# Altium schematic sheet ATMEGA32U4+Micro+Ver1.1.schdoc
size 303 x 221 mm
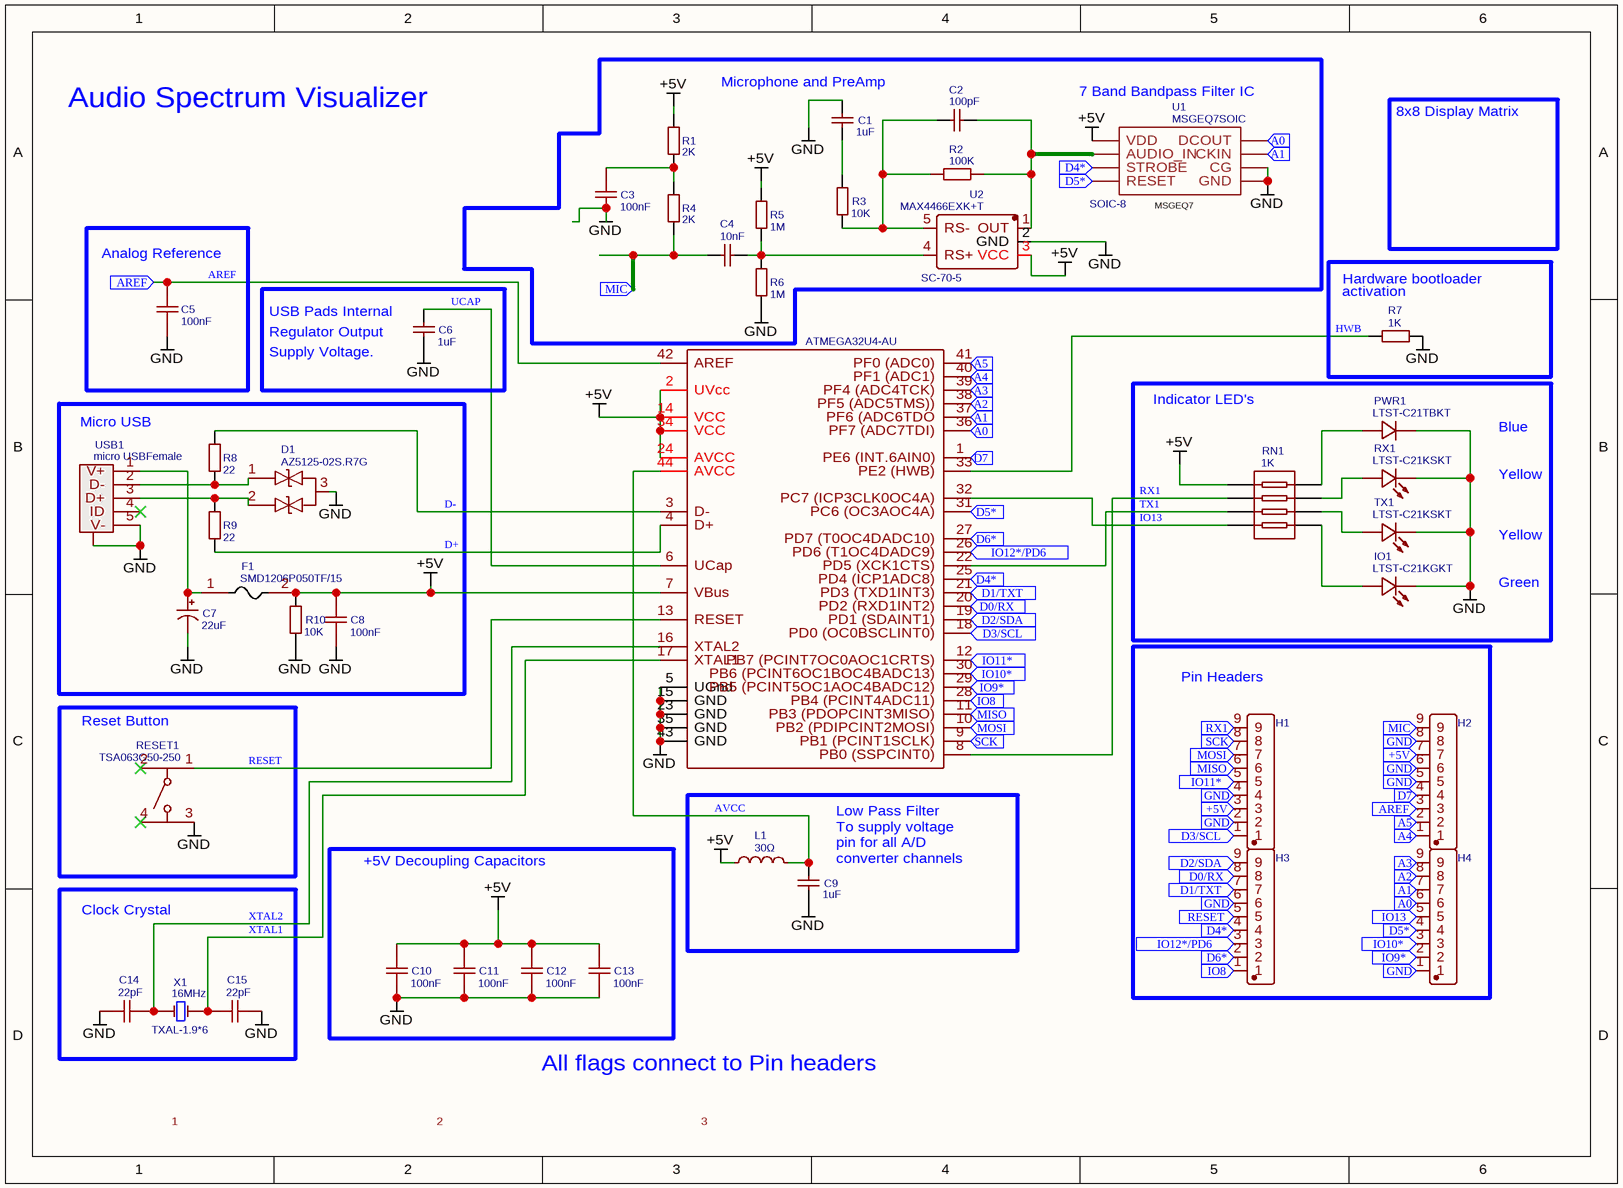
[diagram p0: ATMEGA32U4+Micro+Ver1.1.schdoc]

## Parts
ATMEGA1U4-AU  ATMEGA32U4-AU  [QFP-44_10X10X08P]
C1  1uF  [0603]
C2  100pF  [0603]
C3  100nF  [0603]
C4  10nF  [0603]
C5  100nF  [0603]
C6  1uF  [0603]
C7  22uF  [CAP-SMD_BD5.0-L5.3-W5.3-FD]
C8  100nF  [0603]
C9  1uF  [0603]
C10  100nF  [0603]
C11  100nF  [0603]
C12  100nF  [0603]
C13  100nF  [0603]
C14  22pF  [0805]
C15  22pF  [0805]
D1  AZ5125-02S.R7G  [SOT-23-3_L2.9-W1.6-P1.90-LS2.8-BR]
F1  SMD1206P050TF/15  [FUSE-1206]
H1  A2541WV-9P  [SIP-2.54MM-9P-CJT-H8.54]  (value not drawn)
H2  A2541WV-9P  [SIP-2.54MM-9P-CJT-H8.54]  (value not drawn)
H3  A2541WV-9P  [SIP-2.54MM-9P-CJT-H8.54]  (value not drawn)
H4  A2541WV-9P  [SIP-2.54MM-9P-CJT-H8.54]  (value not drawn)
IO1  LTST-C21KGKT  [LED-SMD-3.2X1.6X1.1]
L1  30Ω  [0805]
PWR1  LTST-C21TBKT  [LED-SMD-3.2X1.6X1.1]
R1  2K  [0603]
R2  100K  [0603]
R3  10K  [0805]
R4  2K  [0603]
R5  1M  [0603]
R6  1M  [0603]
R7  1K  [0805]
R8  22  [0805]
R9  22  [0805]
R10  10K  [0805]
RESET1  TSA063G50-250  [SW-SMD-T6X6-9.5X5.8]
RN1  1K  [1206_X4]
RX1  LTST-C21KSKT  [LED-SMD-3.2X1.6X1.1]
TX1  LTST-C21KSKT  [LED-SMD-3.2X1.6X1.1]
U1  MSGEQ7SOIC  [SOIC-8]
U2  MAX4466EXK+T  [SC-70-5]
USB1  micro USBFemale  [MICRO-USB-1]
X1  16MHz  [TXAL-1.9*6]

## Blocks framed on the sheet
Analog Reference: C5
Micro USB: C7 C8 D1 F1 R8-R10 USB1
Pin Headers: H1-H4
Reset Button: RESET1
+5V Decoupling Capacitors: C10-C13
Clock Crystal: C14 C15 X1

## Ports
+5V, A0, A1, A2, A3, A4, A5, AREF, D0/RX, D1/TXT, D2/SDA, D3/SCL, D4*, D5*, D6*, D7, GND, IO8, IO9*, IO10*, IO11*, IO12*/PD6, IO13, MIC, MISO, MOSI, RESET, RX1, SCK

## Nets
+5V: ATMEGA1U4-AU.2(UVcc) ATMEGA1U4-AU.7(VBus) ATMEGA1U4-AU.14(VCC) ATMEGA1U4-AU.24(AVCC) ATMEGA1U4-AU.34(VCC) C8.2 C10.2 C11.2 C12.2 C13.2 F1.2 L1.1 R1.2 R5.2 R10.2 RN1.5 U1.1(VDD) U2.3(VCC)
GND: ATMEGA1U4-AU.5(UGnd) ATMEGA1U4-AU.15(GND) ATMEGA1U4-AU.23(GND) ATMEGA1U4-AU.35(GND) ATMEGA1U4-AU.43(GND) C1.2 C3.1 C5.1 C6.1 C7.2 C8.1 C9.1 C10.1 C11.1 C12.1 C13.1 C14.1 C15.2 D1.3 IO1.1(C) PWR1.2(-) R6.1 R7.1 R10.1 RESET1.3 RX1.1(C) TX1.1(C) U1.2(GND) U1.6(CG) U2.2(GND) USB1.0(MTN) USB1.5(V-)
+5V: H1.3 H2.7 ; port +5V  [a separate net that carries the same name]
A0: ATMEGA1U4-AU.36(PF7_(ADC7TDI)) H4.6 U1.3(DCOUT) ; port A0
A1: ATMEGA1U4-AU.37(PF6_(ADC6TDO) H4.7 U1.8(CKIN) ; port A1
A2: ATMEGA1U4-AU.38(PF5_(ADC5TMS))) H4.8 ; port A2
A3: ATMEGA1U4-AU.39(PF4_(ADC4TCK)) H4.9 ; port A3
A4: ATMEGA1U4-AU.40(PF1_(ADC1)) H2.1 ; port A4
A5: ATMEGA1U4-AU.41(PF0_(ADC0)) H2.2 ; port A5
AREF: ATMEGA1U4-AU.42(AREF) C5.2 H2.3 ; port AREF
AVCC: ATMEGA1U4-AU.44(AVCC) C9.2 L1.2
D0/RX: ATMEGA1U4-AU.20(PD2_(RXD1INT2)) H3.8 ; port D0/RX
D1/TXT: ATMEGA1U4-AU.21(PD3_(TXD1INT3)) H3.7 ; port D1/TXT
D2/SDA: ATMEGA1U4-AU.19(PD1_(SDAINT1)) H3.9 ; port D2/SDA
D3/SCL: ATMEGA1U4-AU.18(PD0_(OC0BSCLINT0)) H1.1 ; port D3/SCL
D4*: ATMEGA1U4-AU.25(PD4_(ICP1ADC8)) H3.4 U1.4(STROBE) ; port D4*
D5*: ATMEGA1U4-AU.31(PC6_(OC3AOC4A)) H4.4 U1.7(RESET) ; port D5*
D6*: ATMEGA1U4-AU.27(PD7_(T0OC4DADC10)) H3.2 ; port D6*
D7: ATMEGA1U4-AU.1(PE6_(INT.6AIN0)) H2.4 ; port D7
D+: ATMEGA1U4-AU.4(D+) R9.2
D-: ATMEGA1U4-AU.3(D-) R8.2
GND: H1.2 H1.4 H2.5 H2.6 H2.8 H3.6 H4.1 ; port GND  [a separate net that carries the same name]
HWB: ATMEGA1U4-AU.33(PE2_(HWB)) R7.2
IO8: ATMEGA1U4-AU.28(PB4_(PCINT4ADC11)) H3.1 ; port IO8
IO9*: ATMEGA1U4-AU.29(PB5_(PCINT5OC1AOC4BADC12)) H4.2 ; port IO9*
IO10*: ATMEGA1U4-AU.30(PB6_(PCINT6OC1BOC4BADC13)) H4.3 ; port IO10*
IO11*: ATMEGA1U4-AU.12(PB7_(PCINT7OC0AOC1CRTS)) H1.5 ; port IO11*
IO12*/PD6: ATMEGA1U4-AU.26(PD6_(T1OC4DADC9)) H3.3 ; port IO12*/PD6
IO13: ATMEGA1U4-AU.32(PC7_(ICP3CLK0OC4A)) RN1.8
IO13: H4.5 ; port IO13  [a separate net that carries the same name]
MIC: C4.1 H2.9 R4.1 ; port MIC
MISO: ATMEGA1U4-AU.11(PB3_(PDOPCINT3MISO)) H1.6 ; port MISO
MOSI: ATMEGA1U4-AU.10(PB2_(PDIPCINT2MOSI)) H1.7 ; port MOSI
RESET: ATMEGA1U4-AU.13(RESET) RESET1.1
RESET: H3.5 ; port RESET  [a separate net that carries the same name]
RX1: ATMEGA1U4-AU.8(PB0_(SSPCINT0)) RN1.6
RX1: H1.9 ; port RX1  [a separate net that carries the same name]
SCK: ATMEGA1U4-AU.9(PB1_(PCINT1SCLK)) H1.8 ; port SCK
TX1: ATMEGA1U4-AU.22(PD5_(XCK1CTS)) RN1.7
UCAP: ATMEGA1U4-AU.6(UCap) C6.2
XTAL1: ATMEGA1U4-AU.17(XTAL1) C15.1 X1.2(OSC2)
XTAL2: ATMEGA1U4-AU.16(XTAL2) C14.2 X1.1(OSC1)
NetC1_1: C1.1 R3.2
NetC2_1: C2.1 R2.2 R3.1 U2.5(RS-)
NetC2_2: C2.2 R2.1 U1.5(AUDIO_IN) U2.1(OUT)
NetC3_2: C3.2 R1.1 R4.2
NetC4_2: C4.2 R5.1 R6.2 U2.4(RS+)
NetC7_1: C7.1 F1.1 USB1.1(V+)
NetD1_1: D1.1 R8.1 USB1.2(D-)
NetD1_2: D1.2 R9.1 USB1.3(D+)
NetIO1_2: IO1.2(A) RN1.1
NetPWR1_1: PWR1.1(+) RN1.4
NetRN1_2: RN1.2 TX1.2(A)
NetRN1_3: RN1.3 RX1.2(A)

Not connected (* = marked no-connect by the designer): RESET1 2* 4*; USB1 4(ID)*

## Notes on the sheet
- Audio Spectrum Visualizer
- (near C1) Microphone and PreAmp
- (near U1) 7 Band Bandpass Filter IC
- 8x8 Display Matrix
- (near C6) USB Pads Internal
- (near R7) activation
- (near R7) Hardware bootloader
- (near C6) Regulator Output
- Supply Voltage.
- Indicator LED's
- Blue
- Yellow
- Green
- Low Pass Filter
- To supply voltage
- pin for all A/D
- (near C9) converter channels
- All flags connect to Pin headers
- 1
- 2
- 3
- (in symbol 16MHz) TXAL-1.9*6
- (in symbol MAX4466EXK+T) SC-70-5
- (in symbol MSGEQ7SOIC) SOIC-8; MSGEQ7

## Library data of the parts
ATMEGA1U4-AU = ATMEGA32U4-AU: BOM_Manufacturer: MICROCHIP; SMT Type: Extend; BOM_Supplier: LCSC; BOM_Manufacturer Part: ATMEGA32U4-AU; image: //image.lceda.cn/szlcsc/C44854.jpg; BOM_Supplier Part: C44854; BOM_LCSC Assembly: Yes; spicePre: U
C1 C6 C9 = 1uF: BOM_Manufacturer Part: CL10A105KP8NNNC; BOM_Manufacturer: SAMSUNG; nameAlias: Capacitance; BOM_Supplier: LCSC; BOM_Supplier Part: C26413; spicePre: C; spiceSymbolName: CL10A105KP8NNNC
C2 = 100pF: BOM_Manufacturer: FH; BOM_Manufacturer Part: 0603CG101J500NT; nameAlias: Capacitance; SMT Type: Extend; BOM_Supplier: LCSC; BOM_Supplier Part: C1635; BOM_LCSC Assembly: Yes; spicePre: C; spiceSymbolName: 0603CG101J500NT
C3 C5 C8 C10-C13 = 100nF: BOM_Manufacturer: FH; BOM_Manufacturer Part: 0603B104J500NT; nameAlias: Capacitance; BOM_Supplier: LCSC; BOM_Supplier Part: C88136; spicePre: C; spiceSymbolName: 0603B104J500NT
C4 = 10nF: BOM_Manufacturer: FH; BOM_Manufacturer Part: 0603B103J500NT; nameAlias: Capacitance; Contributor: LCSC; BOM_Supplier: LCSC; BOM_Supplier Part: C124567; spicePre: C; spiceSymbolName: 0603B103J500NT
C7 = 22uF: BOM_Manufacturer: HONOR; BOM_Manufacturer Part: RVT1V220M0505; nameAlias: Capacitance; BOM_Supplier: LCSC; BOM_Supplier Part: C23289; spicePre: C; spiceSymbolName: RVT1V220M0505-C23289
C14 C15 = 22pF: BOM_Manufacturer: FH; BOM_Manufacturer Part: 0805CG220J500NT; nameAlias: Capacitance; BOM_Supplier: LCSC; BOM_Supplier Part: C24658; spicePre: C; spiceSymbolName: 0805CG220J500NT
D1 = AZ5125-02S.R7G: BOM_Manufacturer: AMAZING; Contributor: LCSC; BOM_Supplier: LCSC; BOM_Supplier Part: C356820; BOM_Manufacturer Part: AZ5125-02S.R7G; spicePre: D
F1 = SMD1206P050TF/15: BOM_Manufacturer: PTTC; BOM_Supplier: LCSC; BOM_Manufacturer Part: SMD1206P050TF/15; BOM_Supplier Part: C106264; spicePre: F
H1-H4 = A2541WV-9P: BOM_Manufacturer: Changjiang Connectors; Contributor: LCSC; BOM_Supplier: LCSC; BOM_Supplier Part: C225484; BOM_Manufacturer Part: A2541WV-9P; spicePre: H
IO1 = LTST-C21KGKT: BOM_Manufacturer: Lite-On; Contributor: LCSC; BOM_Supplier: LCSC; BOM_Supplier Part: C284938; BOM_Manufacturer Part: LTST-C21KGKT; spicePre: L
L1 = 30Ω: BOM_Manufacturer: ReliaPro; BOM_Manufacturer Part: MLB2012-300P3A(f); nameAlias: Value; BOM_Supplier: LCSC; BOM_Supplier Part: C50503; spicePre: L; spiceSymbolName: MLB2012-300P3A(f)
PWR1 = LTST-C21TBKT: BOM_Manufacturer: Lite-On; Contributor: LCSC; BOM_Supplier: LCSC; BOM_Supplier Part: C284941; BOM_Manufacturer Part: LTST-C21TBKT; spicePre: L
R1 R4 = 2K: BOM_Manufacturer: YAGEO; BOM_Manufacturer Part: RC0603FR-072KL; nameAlias: Resistance (Ohms); BOM_Supplier: LCSC; BOM_Supplier Part: C105576; spicePre: R; spiceSymbolName: RC0603FR-072KL
R2 = 100K: BOM_Manufacturer: YAGEO; BOM_Manufacturer Part: RC0603FR-07100KL; nameAlias: Resistance (Ohms); Contributor: LCSC; BOM_Supplier: LCSC; BOM_Supplier Part: C14675; spicePre: R; spiceSymbolName: RC0603FR-07100KL
R3 R10 = 10K: BOM_Manufacturer: YAGEO; BOM_Manufacturer Part: RC0805FR-0710KL; nameAlias: Resistance (Ohms); BOM_Supplier: LCSC; BOM_Supplier Part: C84376; spicePre: R; spiceSymbolName: RC0805FR-0710KL
R5 R6 = 1M: BOM_Manufacturer: YAGEO; BOM_Manufacturer Part: RC0603FR-071ML; nameAlias: Resistance (Ohms); BOM_Supplier: LCSC; BOM_Supplier Part: C105578; spicePre: R; spiceSymbolName: RC0603FR-071ML
R7 = 1K: BOM_Manufacturer: UniOhm; BOM_Manufacturer Part: 0805W8F1001T5E; nameAlias: Resistance (Ohms); SMT Type: Basic; BOM_Supplier: LCSC; BOM_LCSC Assembly: Yes; BOM_Supplier Part: C17513; spicePre: R; spiceSymbolName: 0805W8F1001T5E
R8 R9 = 22: BOM_Manufacturer: UniOhm; BOM_Manufacturer Part: 0805W8J0220T5E; nameAlias: Resistance (Ohms); BOM_Supplier: LCSC; BOM_Supplier Part: C25295; spicePre: R; spiceSymbolName: 0805W8J0220T5E
RESET1 = TSA063G50-250: BOM_Manufacturer: BRIGHT; Contributor: LCSC; BOM_Supplier: LCSC; BOM_Supplier Part: C294565; BOM_Manufacturer Part: TSA063G50-250; spicePre: S
RN1 = 1K: BOM_Manufacturer: EVER OHMS; BOM_Manufacturer Part: CRA064RJ1KE04; nameAlias: Resistance (Ohms); Contributor: LCSC; BOM_Supplier: LCSC; BOM_Supplier Part: C149873; spicePre: R; spiceSymbolName: CRA064RJ1KE04
RX1 TX1 = LTST-C21KSKT: BOM_Manufacturer: Lite-On; Contributor: LCSC; BOM_Supplier: LCSC; BOM_Supplier Part: C284940; BOM_Manufacturer Part: LTST-C21KSKT; spicePre: L
U1 = MSGEQ7SOIC: description: 7-band graphic equalizer; Contributor: SparkFun; Package Display: Yes; spicePre: U
U2 = MAX4466EXK+T: BOM_Manufacturer: Maxim Integrated; BOM_Manufacturer Part: MAX4073TAXK+T; Contributor: LCSC; SMT Type: Extend; Package Display: Yes; BOM_Supplier: LCSC; BOM_Supplier Part: C143459; BOM_LCSC Assembly: Yes; spicePre: U
USB1 = micro USBFemale: BOM_Manufacturer: ValuePro; BOM_Supplier: LCSC; BOM_Manufacturer Part: micro USBFemale; image: //image.lceda.cn/szlcsc/C10418.jpg; BOM_Supplier Part: C10418; spicePre: U
X1 = 16MHz: BOM_Manufacturer Part: X206016MSD2SC; BOM_Manufacturer: YXC; nameAlias: Frequency; Package Display: Yes; BOM_Supplier: LCSC; BOM_Supplier Part: C2174; spicePre: X; spiceSymbolName: X206016MSD2SC